# EAGLE schematic security-main (EAGLE 9.0.1)
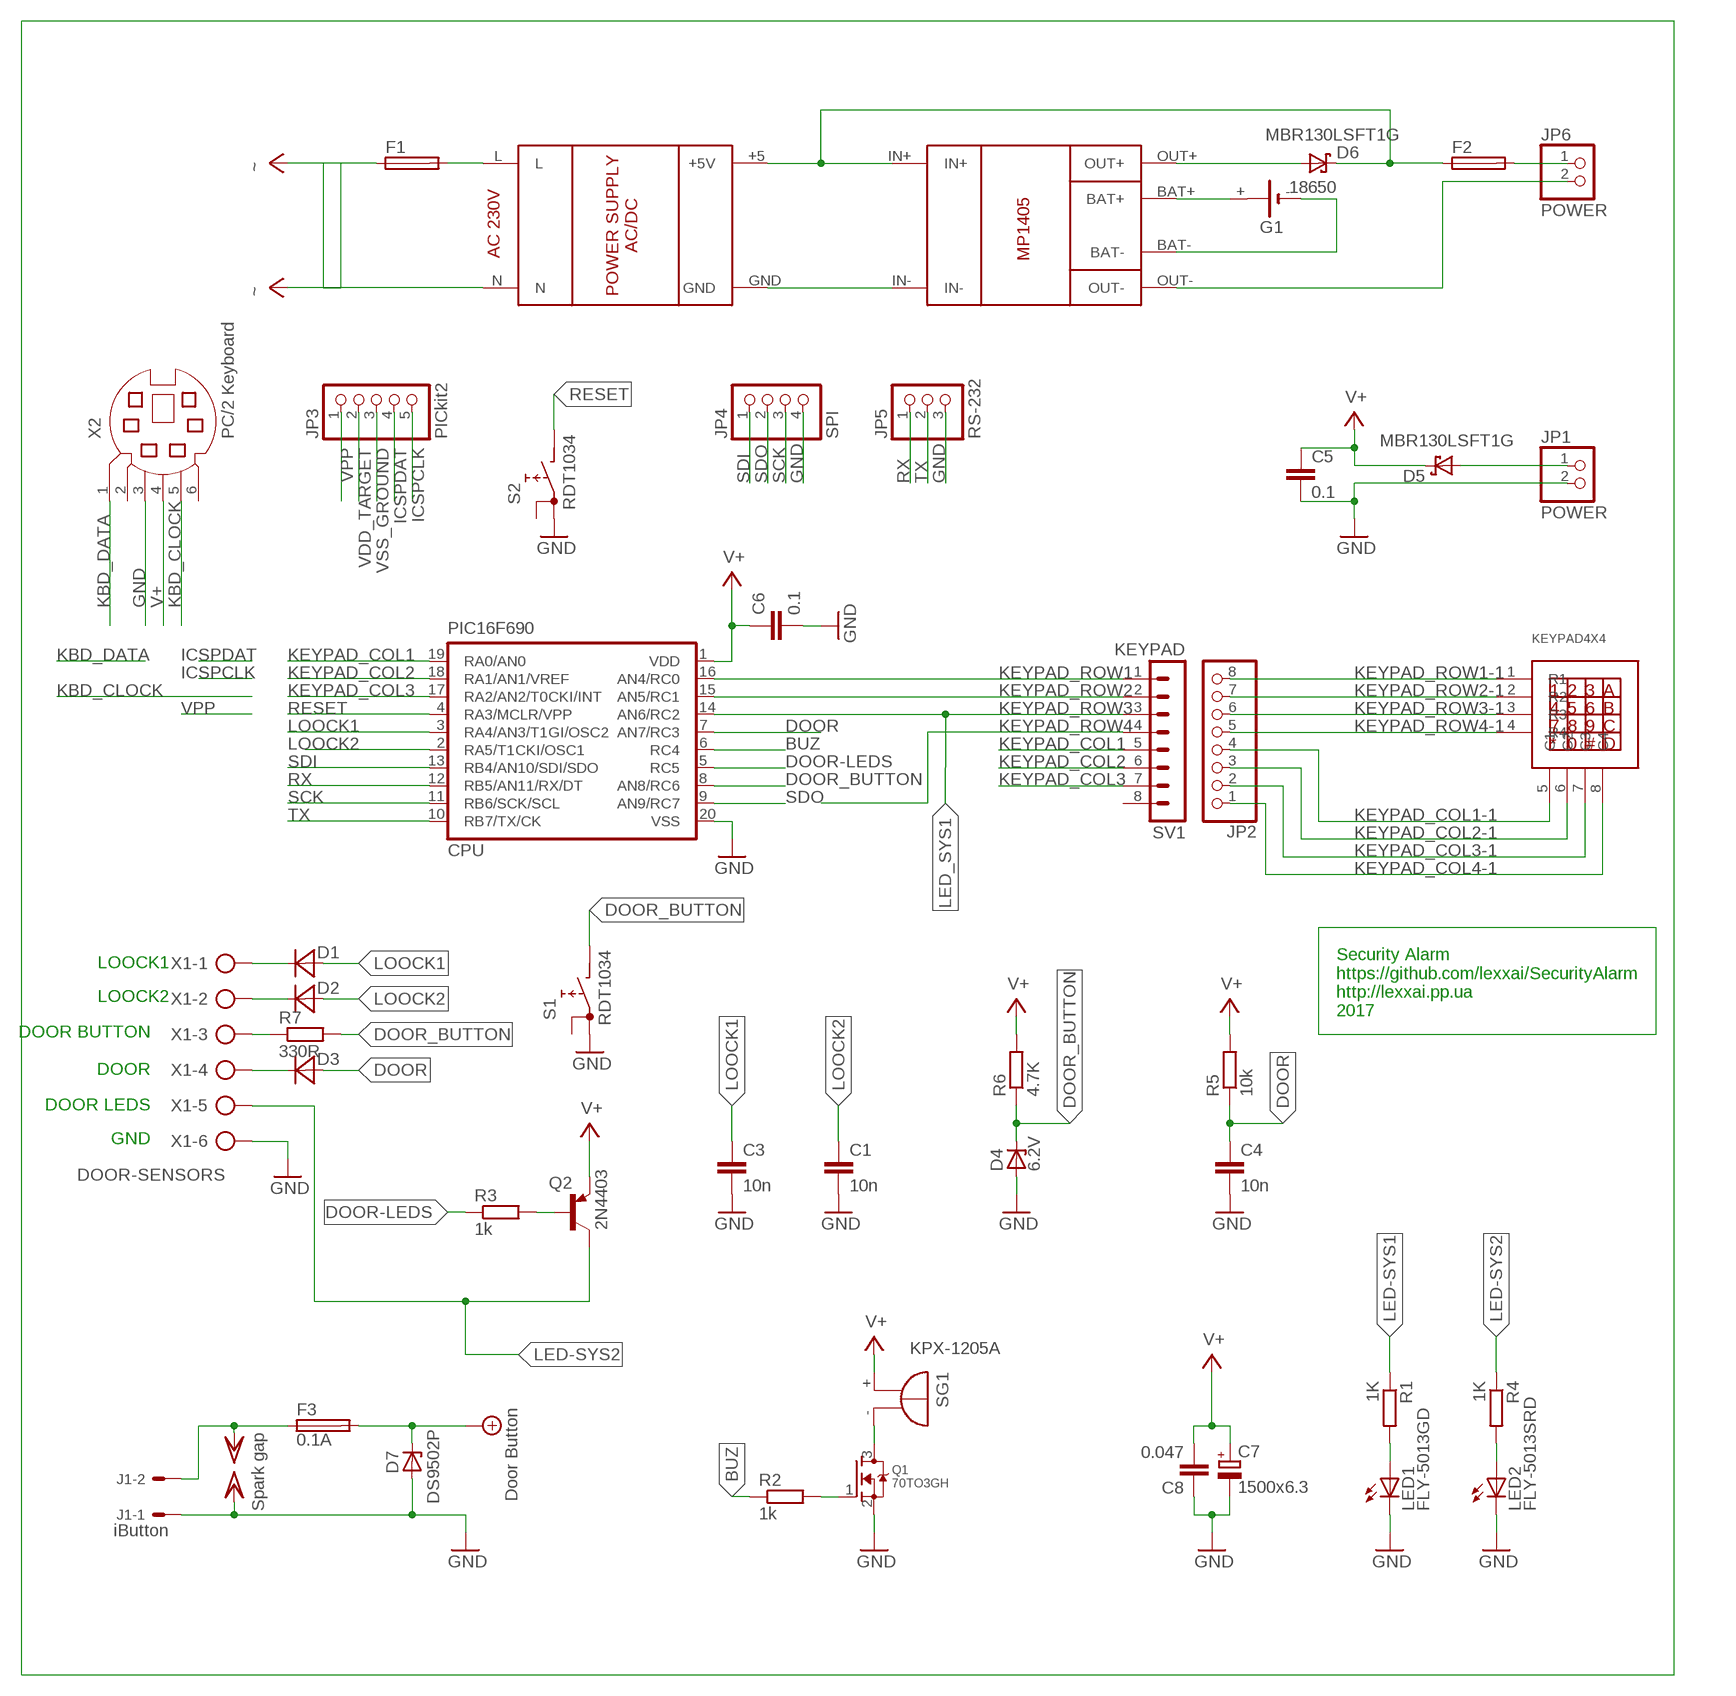
[diagram p0: schematic, sheet 1]

## Parts
C1  10n  C2,5-3  [C2.5-3]
C3  10n  C2,5-3  [C2.5-3]
C4  10n  C2,5-3  [C2.5-3]
C5  0.1  C2,5-3  [C2.5-3]
C6  0.1  C2,5-3  [C2.5-3]
C7  1500x6.3  CPOL-EU153CLV-0505  [153CLV-0505]
C8  0.047  C2,5-3  [C2.5-3]
D1  MBRA340T3  [SMA]
D2  MBRA340T3  [SMA]
D3  MBRA340T3  [SMA]
D4  6.2V  ZENER-DIODEDO35Z10  [DO35Z10]
D5  MBR130LSFT1G  DS_E2L  [E2LINE]
D6  MBR130LSFT1G  DS_E2L  [E2LINE]
D7  DS9502P  ZENER-DIODEZD-12.5  [ZDIO12.5]
F1  TE5  [TE5]
F2  TE5  [TE5]
F3  0.1A  19559  [19559]
G1  18650  CRAA  [CRAA]
J1  iButton  22-05-7028-02  [7395-02]
JP1  POWER  PINHD-1X2/90  [1X02/90]
JP2  PINHD-1X8CLEANBIG  [1X08-CLEANBIG]
JP3  PICkit2  PINHD-1X5  [1X05]
JP4  SPI  PINHD-1X4  [1X04]
JP5  RS-232  PINHD-1X3  [1X03]
JP6  POWER  PINHD-1X2/90  [1X02/90]
KEYPAD4X4  KEYPAD4X4  [KEYPAD4X4]
LED1  FLY-5013GD  W49180  [Z-POWER-LED-DOME-TYPE]
LED2  FLY-5013SRD  W49180  [Z-POWER-LED-DOME-TYPE]
PIC16F690  CPU  PIC16F6XX  [DIL20]
Q1  70TO3GH  MOSFET-NREFLOW  [SOT23]
Q2  2N4403  MPSA56-TO92  [TO92-CBE]
R1  1K  R-EU_0204/2V  [0204V]
R2  1k  R-EU_0204/2V  [0204V]
R3  1k  R-EU_0204/2V  [0204V]
R4  1K  R-EU_0204/2V  [0204V]
R5  10k  R-EU_0204/2V  [0204V]
R6  4.7K  R-EU_0204/2V  [0204V]
R7  330R  R-EU_0204/2V  [0204V]
S1  RDT1034  [RDT1034]
S2  RDT1034  [RDT1034]
SG1  KPX-1205A  EB2209A  [EB2209A]
SV1  KEYPAD  MA08-1  [MA08-1]
U$1  POWER_CHARGER+5PS1  [POWER-PAC]
U$2  MP1405  [MP1405-PAC]
X1  DOOR-SENSORS  AK300/6  [AK300/6]
X2  PC/2 Keyboard  MD06SS  [MDIN06SS]

## Nets
+5V: F3.1 J1.2 ; supply symbol labelled Spark gap
BUZ: PIC16F690.6(RC4) R2.1
DOOR: C4.1 D3.A PIC16F690.7(AN7/RC3) R5.1
DOOR-1: D3.C X1.4
DOOR-LEDS: PIC16F690.5(RC5) R3.1
DOOR_BUTTON: D4.C PIC16F690.8(AN8/RC6) R6.1 R7.2 S1.B
DOOR_BUTTON-1: R7.1 X1.3
GND: C1.2 C3.2 C4.2 C5.2 C6.2 C7.- C8.1 D4.A D7.A J1.1 JP1.2 JP4.4 JP5.3 LED1.C LED2.C PIC16F690.20(VSS) Q1.2(S) S1.A1 S2.A1 X1.6 X2.3
ICSPCLK: JP3.5
ICSPDAT: JP3.4
KBD_CLOCK: X2.5
KBD_DATA: X2.1
KEYPAD_COL1: PIC16F690.19(RA0/AN0) SV1.5
KEYPAD_COL1-1: JP2.4 KEYPAD4X4.5(C1)
KEYPAD_COL2: PIC16F690.18(RA1/AN1/VREF) SV1.6
KEYPAD_COL2-1: JP2.3 KEYPAD4X4.6(C2)
KEYPAD_COL3: PIC16F690.17(RA2/AN2/T0CKI/INT) SV1.7
KEYPAD_COL3-1: JP2.2 KEYPAD4X4.7(C3)
KEYPAD_COL4-1: JP2.1 KEYPAD4X4.8(C4)
KEYPAD_ROW1: PIC16F690.16(AN4/RC0) SV1.1
KEYPAD_ROW1-1: JP2.8 KEYPAD4X4.1(R1)
KEYPAD_ROW2: PIC16F690.15(AN5/RC1) SV1.2
KEYPAD_ROW2-1: JP2.7 KEYPAD4X4.2(R2)
KEYPAD_ROW3: PIC16F690.14(AN6/RC2) SV1.3
KEYPAD_ROW3-1: JP2.6 KEYPAD4X4.3(R3)
KEYPAD_ROW4: SV1.4
KEYPAD_ROW4-1: JP2.5 KEYPAD4X4.4(R4)
LED-SYS1: R1.1
LED-SYS2: Q2.C R4.1 X1.5
LOOCK1: C3.1 D1.A PIC16F690.3(RA4/AN3/T1GI/OSC2)
LOOCK2: C1.1 D2.A PIC16F690.2(RA5/T1CKI/OSC1)
LOOK1-1: D1.C X1.1
LOOK2-1: D2.C X1.2
N$1: Q1.1(G) R2.2
N$2: Q1.3(D) SG1.-
N$3: LED2.A R4.2
N$4: D5.2(A) JP1.1
N$7: G1.+ U$2.BAT+
N$8: G1.- U$2.BAT-
N$9: D6.1(K) F2.1 U$1.+5(+5V) U$2.IN+
N$10: U$1.GND U$2.IN-
N$11: D6.2(A) U$2.OUT+
N$12: Q2.B R3.2
N$13: JP6.2 U$2.OUT-
N$14: F2.2 JP6.1
N$15: LED1.A R1.2
N$16: F1.2 U$1.L
N$17: U$1.N
N$18: F1.1
N$21: D7.C F3.2 ; supply symbol labelled Door Button
RESET: PIC16F690.4(RA3/MCLR/VPP) S2.B
RX: JP5.1 PIC16F690.12(RB5/AN11/RX/DT)
SCK: JP4.3 PIC16F690.11(RB6/SCK/SCL)
SDI: JP4.1 PIC16F690.13(RB4/AN10/SDI/SDO)
SDO: JP4.2 PIC16F690.9(AN9/RC7)
TX: JP5.2 PIC16F690.10(RB7/TX/CK)
V+: C5.1 C6.1 C7.+ C8.2 D5.1(K) PIC16F690.1(VDD) Q2.E R5.2 R6.2 SG1.+ X2.4
VDD_TARGET: JP3.2
VPP: JP3.1
VSS_GROUND: JP3.3
Unconnected: G1.+@1(+) S1.A S2.A SV1.8 X2.2 X2.6

## Notes on the sheet
- LOOCK1
- LOOCK2
- Security Alarm 
  https://github.com/lexxai/SecurityAlarm
  http://lexxai.pp.ua
  2017
- DOOR BUTTON
- DOOR
- DOOR LEDS
- GND

## Library data of the parts
C1 C3-C6 C8 = capacitor-wima:C: CAPACITOR naming: grid - package width
C7 = rcl:CPOL-EU: POLARIZED CAPACITOR, European symbol
D1-D3 = diode:MBRA340T3: Surface Mount Schottky Power Rectifier Source: http://www.onsemi.com/pub_link/Collateral/MBRA340T3-D.PDF
D4 D7 = diode:ZENER-DIODE: Z-Diode
D5 D6 = zetex:DS_E2L: SHOTTKY DIODE; OC_FARNELL: unknown; OC_NEWARK: unknown
F1 F2 = fuse:TE5: FUSE Wickmann; OC_FARNELL: unknown; OC_NEWARK: unknown
F3 = fuse:19559: FUSE HOLDER TR5, Wickmann; MPN: 55900000001; OC_FARNELL: 9516360; OC_NEWARK: 02P0286
G1 = battery:CRAA: LI BATTERY Varta
J1 = con-molex:22-?-02: CONNECTOR wire to board 2.54 mm (.1 inch) pitch header; OC_FARNELL: 9731601; OC_NEWARK: unknown
JP1 JP6 = pinhead:PINHD-1X2: PIN HEADER
JP2 = adafruit:PINHD-1X8: PIN HEADER
JP3 = pinhead:PINHD-1X5: PIN HEADER
JP4 = pinhead:PINHD-1X4: PIN HEADER
JP5 = adafruit:PINHD-1X3: PIN HEADER
KEYPAD4X4 = keypad4x4_ece:KEYPAD4X4
LED1 LED2 = led:W49180: Z-Power LED P4 Series, Dome type Source: http://www.acriche.com .. W49180.pdf
PIC16F690 = pic16f690:PIC16F6XX
Q1 = adafruit:MOSFET-N: N-Channel Mosfet 2N7002E - 60V 260mA SOT23 [Digikey: 2N7002ET1GOSTR-ND] - REEL BSH103 - 30V 850mA SOT23 [Digikey: 568-5013-1-ND]
Q2 = transistor-pnp:*-?: PNP Transistor
R1-R7 = resistor:R-EU_: RESISTOR, European symbol
S1 S2 = switch:RDT1034: PUSH SWITCH www.radiohm.com
SG1 = buzzer:EB2209A: BUZZER Source: Buerklin; OC_FARNELL: unknown; OC_NEWARK: unknown
SV1 = con-lstb:MA08-1: PIN HEADER; OC_FARNELL: unknown; OC_NEWARK: unknown
U$1 = lex-library:POWER_CHARGER+5: Mobile Charger +5V
U$2 = lex-library:MP1405: POWER
X1 = con-ptr500:AK300/6: CONNECTOR; OC_FARNELL: unknown; OC_NEWARK: unknown
X2 = con-yamaichi:MD06SS: YAMAICHI CONNECTOR; OC_FARNELL: unknown; OC_NEWARK: unknown